# EAGLE design Key PCB (EAGLE 9.6.2)
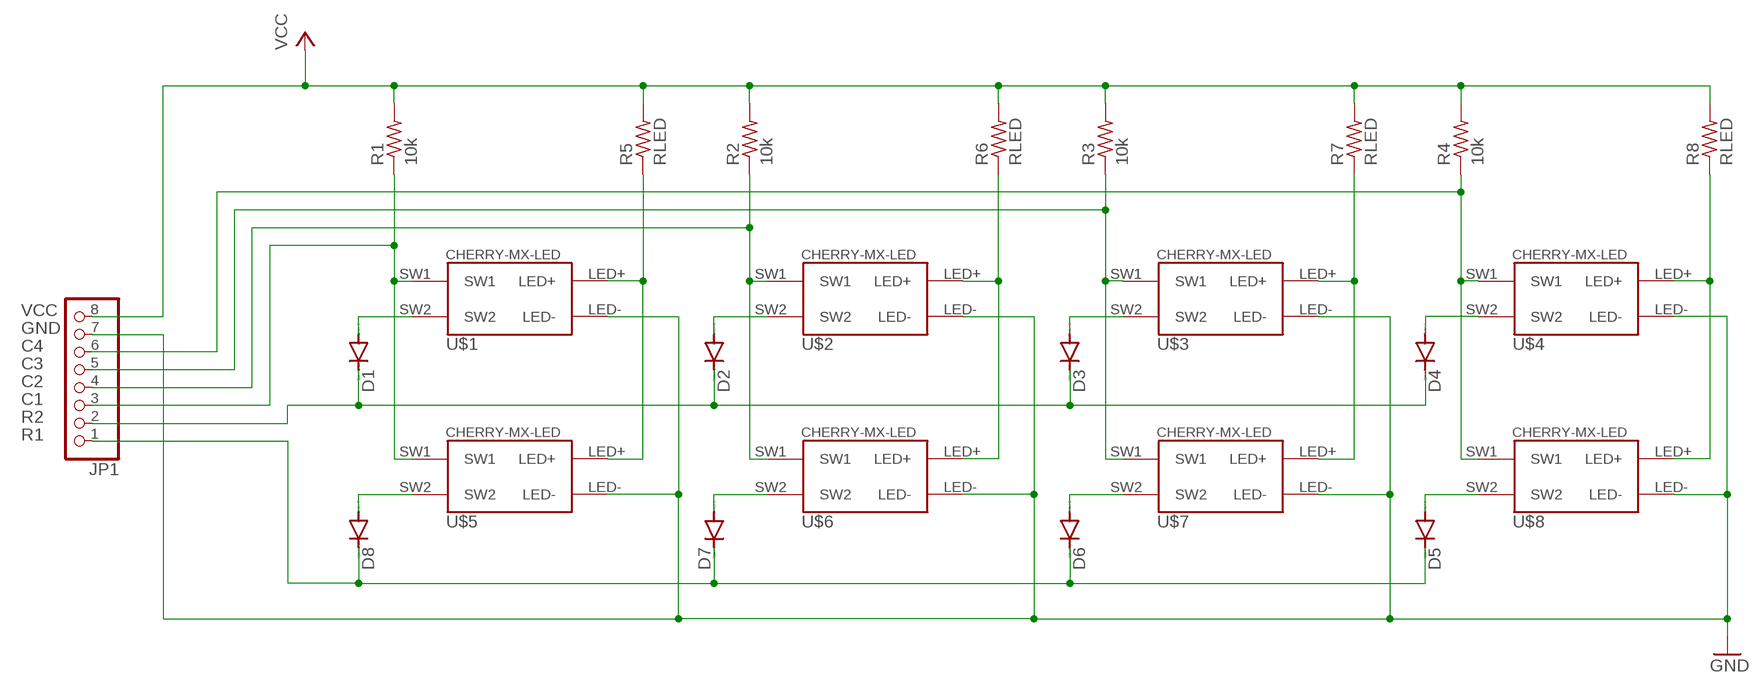
[diagram p0: schematic, sheet 1]

## Parts
D1  1N4148DO35-7  [DO35-7]
D2  1N4148DO35-7  [DO35-7]
D3  1N4148DO35-7  [DO35-7]
D4  1N4148DO35-7  [DO35-7]
D5  1N4148DO35-7  [DO35-7]
D6  1N4148DO35-7  [DO35-7]
D7  1N4148DO35-7  [DO35-7]
D8  1N4148DO35-7  [DO35-7]
JP1  PINHD-1X8  [1X08]
R1  10k  R-US_0207/10  [0207/10]
R2  10k  R-US_0207/10  [0207/10]
R3  10k  R-US_0207/10  [0207/10]
R4  10k  R-US_0207/10  [0207/10]
R5  RLED  R-US_0207/10  [0207/10]
R6  RLED  R-US_0207/10  [0207/10]
R7  RLED  R-US_0207/10  [0207/10]
R8  RLED  R-US_0207/10  [0207/10]
U$1  CHERRY-MX-LED  [CHERRY-MX-LED]
U$2  CHERRY-MX-LED  [CHERRY-MX-LED]
U$3  CHERRY-MX-LED  [CHERRY-MX-LED]
U$4  CHERRY-MX-LED  [CHERRY-MX-LED]
U$5  CHERRY-MX-LED  [CHERRY-MX-LED]
U$6  CHERRY-MX-LED  [CHERRY-MX-LED]
U$7  CHERRY-MX-LED  [CHERRY-MX-LED]
U$8  CHERRY-MX-LED  [CHERRY-MX-LED]

## Nets
C1: JP1.3 R1.1 U$1.SW1 U$5.SW1
C2: JP1.4 R2.1 U$2.SW1 U$6.SW1
C3: JP1.5 R3.1 U$3.SW1 U$7.SW1
C4: JP1.6 R4.1 U$4.SW1 U$8.SW1
GND: JP1.7 U$1.LED- U$2.LED- U$3.LED- U$4.LED- U$5.LED- U$6.LED- U$7.LED- U$8.LED-
N$5: D4.A U$4.SW2
N$7: D1.A U$1.SW2
N$8: D2.A U$2.SW2
N$9: D3.A U$3.SW2
N$10: D6.A U$7.SW2
N$11: D7.A U$6.SW2
N$12: D8.A U$5.SW2
N$14: D5.A U$8.SW2
N$15: R5.1 U$1.LED+ U$5.LED+
N$16: R6.1 U$2.LED+ U$6.LED+
N$17: R7.1 U$3.LED+ U$7.LED+
N$18: R8.1 U$4.LED+ U$8.LED+
R1: D5.C D6.C D7.C D8.C JP1.1
R2: D1.C D2.C D3.C D4.C JP1.2
VCC: JP1.8 R1.2 R2.2 R3.2 R4.2 R5.2 R6.2 R7.2 R8.2

## Library data of the parts
D1-D8 = diode:1N4148: DIODE high speed (Philips)
JP1 = pinhead8:PINHD-1X8: PIN HEADER
R1-R8 = rcl:R-US_: RESISTOR, American symbol; SPICEPREFIX: R
U$1-U$8 = cherrymx:CHERRY-MX-LED: Cherry MX series keyswitch with LED

## Board
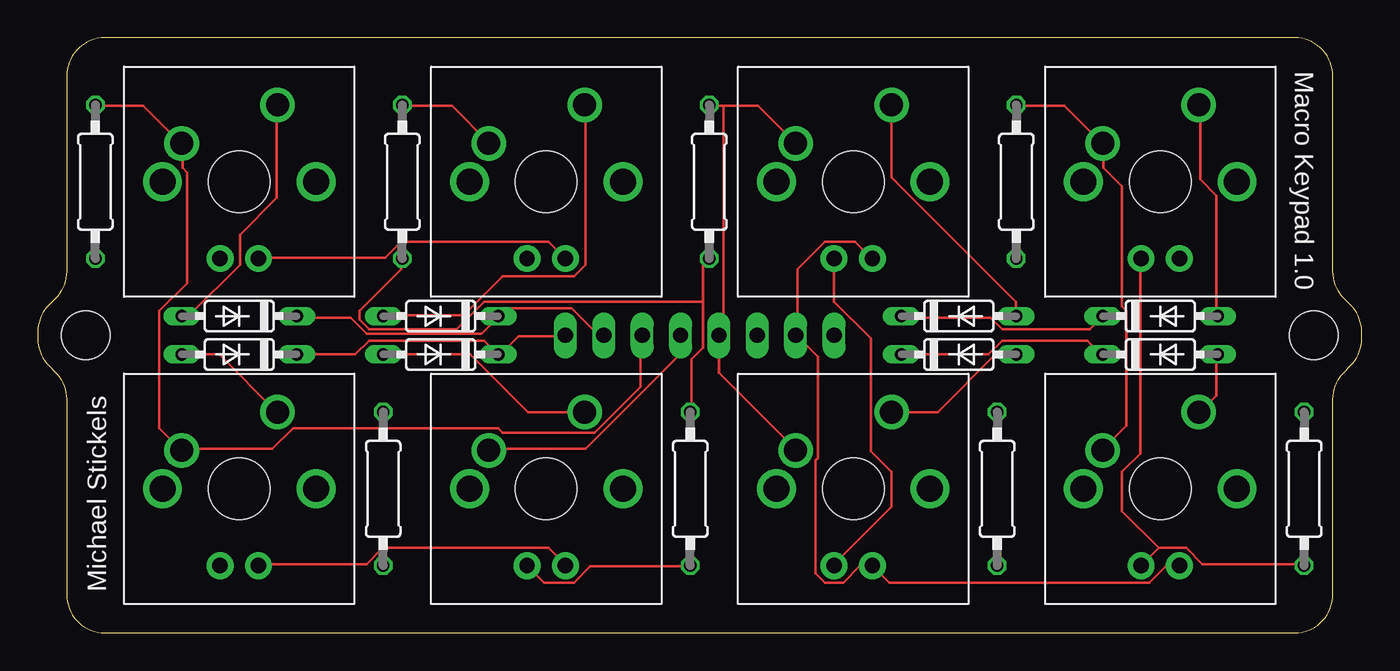
[diagram p1: board, top side]
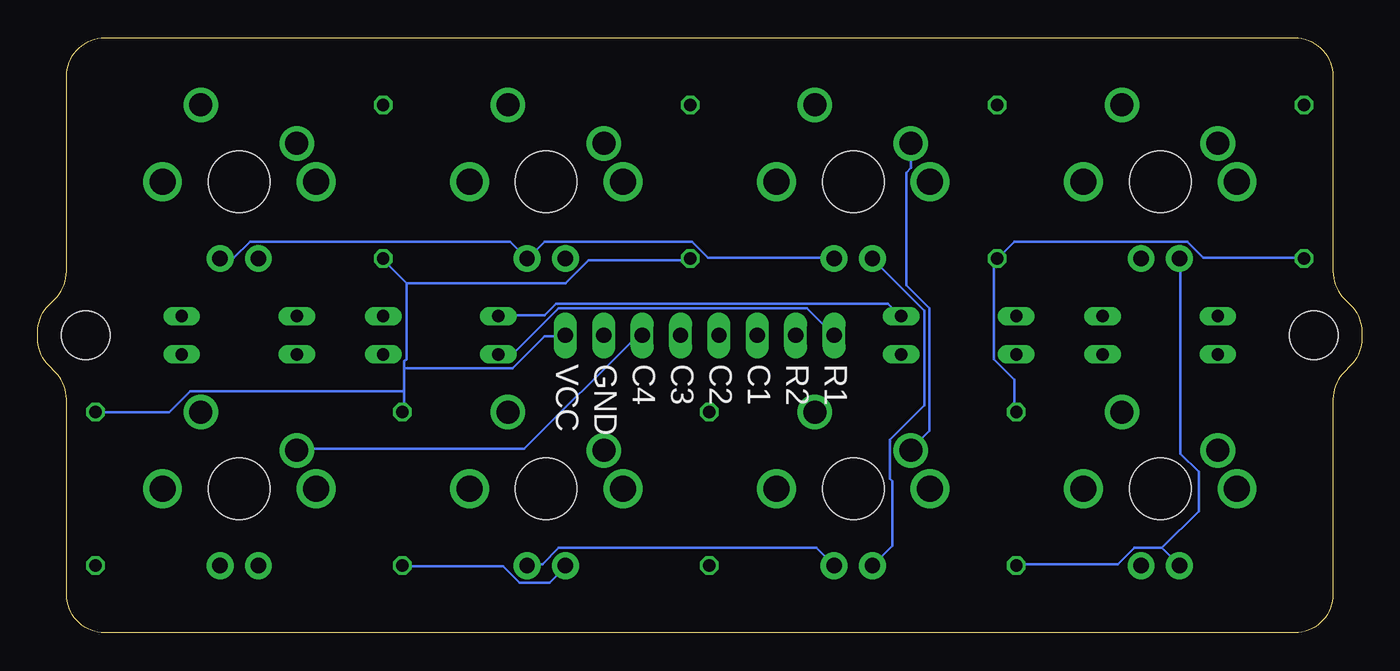
[diagram p2: board, bottom side, seen from below]

Size 87.63 x 39.37 mm. Coordinates in mm from the lower left corner, seen from the top.
Outline: 86.89,21.7 86.47,22.12 arc-45 85.72,23.91 85.72,36.83 arc90 83.18,39.37 4.45,39.37 arc90 1.91,36.83 1.91,23.91 arc-45 1.16,22.12 0.74,21.7 arc45 0,19.9 0,19.47 arc45 0.74,17.67 1.16,17.25 arc-45 1.91,15.46 1.91,2.54 arc90 4.45,0 83.18,0 arc90 85.72,2.54 85.72,15.46 arc-45 86.47,17.25 86.89,17.67 arc45 87.63,19.47 87.63,19.9 arc45 86.89,21.7
Copper layers (1*16): Top 0.035559375mm / dielectric 1.6mm / Bottom 0.035559375mm
Design rules "oshpark-2layer": minimum track width 6mil, minimum drill 10mil, track to track 6mil, track to pad 6mil, pad to pad 6mil, via to via 6mil, smd to smd 6mil, copper to edge 15mil, drill to drill 6mil, minimum pad ring 5mil, minimum via ring 5mil, stop-mask expansion 2.5mil, vias tented up to drill 0mil, thermal gap 10mil
Holes 3.2 mm at 3.17,19.68 84.45,19.68

### Footprints (pad centres in the part's own frame; a part is rotated, then mirrored left to right if it is on the bottom)
DO35-7 = drill 0.813 long: A 3.81,0; C -3.81,0
1X08 = drill 1.016 long: 1 -8.89,0; 2 -6.35,0; 3 -3.81,0; 4 -1.27,0; 5 1.27,0; 6 3.81,0; 7 6.35,0; 8 8.89,0
0207/10 = drill 0.813 octagon: 1 -5.08,0; 2 5.08,0
CHERRY-MX-LED = drill 1.016 pad 1.778: LED+ -1.27,-5.08; LED- 1.27,-5.08 | drill 1.714 pad 1.93: P$3 -5.08,0; P$4 5.08,0 | drill 1.524 pad 2.286: SW1 -3.81,2.54; SW2 2.54,5.08 | hole 4.064: 0,0

### Placement (x,y rotation side)
D1  13.34,20.95 180 top
D2  26.67,20.95 180 top
D3  60.96,20.95 0 top
D4  74.3,20.95 0 top
D5  74.3,18.41 0 top
D6  60.96,18.41 0 top
D7  26.67,18.41 180 top
D8  13.34,18.41 180 top
JP1  43.82,19.68 0 top
R1  3.81,29.84 270 top
R2  24.13,29.84 270 top
R3  44.45,29.84 270 top
R4  64.77,29.84 270 top
R5  22.86,9.53 90 top
R6  43.18,9.53 90 top
R7  63.5,9.53 90 top
R8  83.82,9.53 90 top
U$1  13.34,29.84 0 top
U$2  33.66,29.84 0 top
U$3  53.98,29.84 0 top
U$4  74.3,29.84 0 top
U$5  13.34,9.53 0 top
U$6  33.66,9.53 0 top
U$7  53.98,9.53 0 top
U$8  74.3,9.53 0 top

### Tracks (layer width: path | path; a pad name or v marks a point on that pad's centre or on a via)
C1
  Top 0.152: R1.1 3.94,34.87 6.99,34.87 9.42,32.44 U$1.SW1 9.58,32.28 9.58,30.76 9.88,30.45 9.88,23.14 8.05,21.31 8.05,13.54 U$5.SW1 9.58,12.17 15.52,12.17 16.89,13.54 30.45,13.54 30.76,13.23 36.86,13.23 39.9,16.28 39.9,19.63 JP1.3
C2
  Top 0.152: R2.1 24.21,34.87 27.41,34.87 29.84,32.44 U$2.SW1 | JP1.4 42.49,19.63 42.49,18.41 36.25,12.17 29.84,12.17 U$6.SW1
  Bottom 0.152: U$2.SW1 29.84,30.76 30.15,30.45 30.15,22.99 28.63,21.46 28.63,13.39 29.84,12.17 U$6.SW1
C3
  Top 0.152: 45.39,34.87 47.68,34.87 U$3.SW1 | 45.39,34.87 44.48,34.87 R3.1 | U$7.SW1 50.11,12.17 45.09,17.2 JP1.5 45.09,19.79 45.39,20.09 45.39,34.87
C4
  Top 0.152: R4.1 64.9,34.87 67.94,34.87 70.38,32.44 U$4.SW1 70.54,32.28 70.54,30.76 71.75,29.54 71.75,21.61 72.06,21.31 72.06,13.69 70.54,12.17 U$8.SW1
  Bottom 0.152: JP1.6 47.68,19.63 47.98,19.63 55.45,12.17 70.38,12.17 U$8.SW1
GND
  Top 0.152: U$5.LED- 14.61,4.55 21.77,4.55 22.83,5.61 33.81,5.61 34.87,4.55 U$6.LED- | U$8.LED- 75.56,4.39 74.65,4.39 73.58,3.33 56.36,3.33 U$7.LED- 55.14,4.39 54.38,4.39 53.32,3.33 52.09,3.33 51.49,3.94 51.49,11.4 51.64,11.56 51.64,18.26 50.27,19.63 JP1.7 50.27,19.79 50.27,24.05 52.09,25.88 54.08,25.88 55.14,24.82 U$3.LED- | U$2.LED- 33.81,25.88 24.05,25.88 22.99,24.82 14.61,24.82 U$1.LED-
  Bottom 0.152: U$6.LED- 36.09,5.61 53.16,5.61 54.23,4.55 55.14,4.55 U$7.LED- | U$4.LED- 75.56,24.82 74.65,24.82 73.58,25.88 56.36,25.88 U$3.LED- 55.14,24.82 54.08,25.88 44.32,25.88 43.26,24.82 35.03,24.82 U$2.LED-
N$5
  Top 0.152: D4.A 78,21.01 78,28.93 76.94,30 76.94,34.87 U$4.SW2
N$7
  Top 0.152: D1.A 9.58,21.01 10.03,21.01 13.39,24.36 13.39,26.34 15.82,28.78 15.82,34.87 U$1.SW2
N$8
  Top 0.152: D2.A 22.99,21.01 28.17,21.01 30.76,23.6 35.48,23.6 36.25,24.36 36.25,34.87 U$2.SW2
N$9
  Top 0.152: U$3.SW2 56.52,30.15 64.74,21.92 64.74,21.01 D3.A
N$10
  Top 0.152: D6.A 63.37,18.41 59.56,14.61 U$7.SW2
N$11
  Top 0.152: D7.A 28.63,18.41 32.44,14.61 U$6.SW2
N$12
  Top 0.152: D8.A 12.01,18.41 15.82,14.61 U$5.SW2
N$14
  Top 0.152: D5.A 78,18.41 78,15.67 76.94,14.61 U$8.SW2
N$15
  Bottom 0.152: 13.23,5.61 15.06,5.61 16.13,4.55 22.83,4.55 R5.1 | U$5.LED+ 13.23,5.61 | 13.23,5.61 10.79,8.05 10.79,10.64 12.01,11.86 12.01,24.66 U$1.LED+
N$16
  Top 0.152: U$6.LED+ 33.5,3.33 35.48,3.33 36.55,4.39 43.1,4.39 R6.1
  Bottom 0.152: U$2.LED+ 28.93,21.31 28.93,15.06 31.22,12.78 31.22,10.19 31.06,10.03 31.06,5.77 U$6.LED+
N$17
  Top 0.152: U$3.LED+ 52.71,21.92 55.14,19.48 55.14,12.01 56.52,10.64 56.52,8.36 52.71,4.55 U$7.LED+
  Bottom 0.152: R7.1 63.37,4.39 56.82,4.39 55.75,3.33 53.77,3.33 52.71,4.39 U$7.LED+
N$18
  Top 0.152: 74.19,5.61 76.02,5.61 77.09,4.55 83.8,4.55 R8.1 | U$8.LED+ 74.19,5.61 | 74.19,5.61 71.75,8.05 71.75,10.64 72.97,11.86 72.97,24.66 U$4.LED+
R1
  Top 0.152: D6.C 62.92,18.41 63.83,19.33 69.47,19.33 70.38,18.41 D5.C | D8.C 21.01,18.41 21.92,19.33 29.54,19.33 30.45,18.41 D7.C 30.61,18.41 31.83,19.63 34.87,19.63 JP1.1
  Bottom 0.152: D6.C 56.21,18.41 53.16,21.46 36.7,21.46 JP1.1
R2
  Top 0.152: D4.C 69.62,20.09 63.83,20.09 63.07,20.85 57.28,20.85 D3.C | D1.C 17.2,20.85 20.7,20.85 21.77,19.79 29.39,19.79 30.45,20.85 D2.C 30.61,21.01 31.06,21.46 35.33,21.46 37.01,19.79 37.47,19.79 JP1.2
  Bottom 0.152: D3.C 57.12,21.01 54.08,21.01 53.32,21.77 31.37,21.77 30.61,21.01 D2.C
VCC
  Top 0.152: 44.02,21.92 44.02,24.36 44.32,24.66 R3.2 | 44.02,21.92 44.02,18.87 43.26,18.11 43.26,14.61 R6.2 | 44.02,21.92 29.54,21.92 27.71,20.09 21.92,20.09 21.31,20.7 21.31,21.31 24.05,24.05 24.05,24.66 R2.2
  Bottom 0.152: R5.2 22.99,14.61 22.99,16.74 24.36,18.11 24.36,24.51 24.21,24.66 R2.2 24.05,24.82 22.99,25.88 11.56,25.88 10.49,24.82 3.94,24.82 R1.2 | 63.37,17.5 63.37,17.96 63.22,18.11 63.22,23.14 | 63.37,17.5 63.37,15.98 | 63.37,15.98 63.37,14.61 R7.2 | 63.22,23.14 64.74,24.66 R4.2 | R8.2 78.92,14.61 77.55,15.98 63.37,15.98 | 63.37,17.5 56.21,17.5 54.08,19.63 52.71,19.63 JP1.8 | 63.22,23.14 52.71,23.14 51.18,24.66 44.48,24.66 R3.2

### Text on the board
tPlace: Macro Keypad 1.0 | Michael Stickels
bPlace: R1 | R2 | C1 | C2 | C3 | C4 | GND | VCC